# Altium schematic sheet 07-ZYNQ BANK 502.SchDoc
size 513 x 386 mm
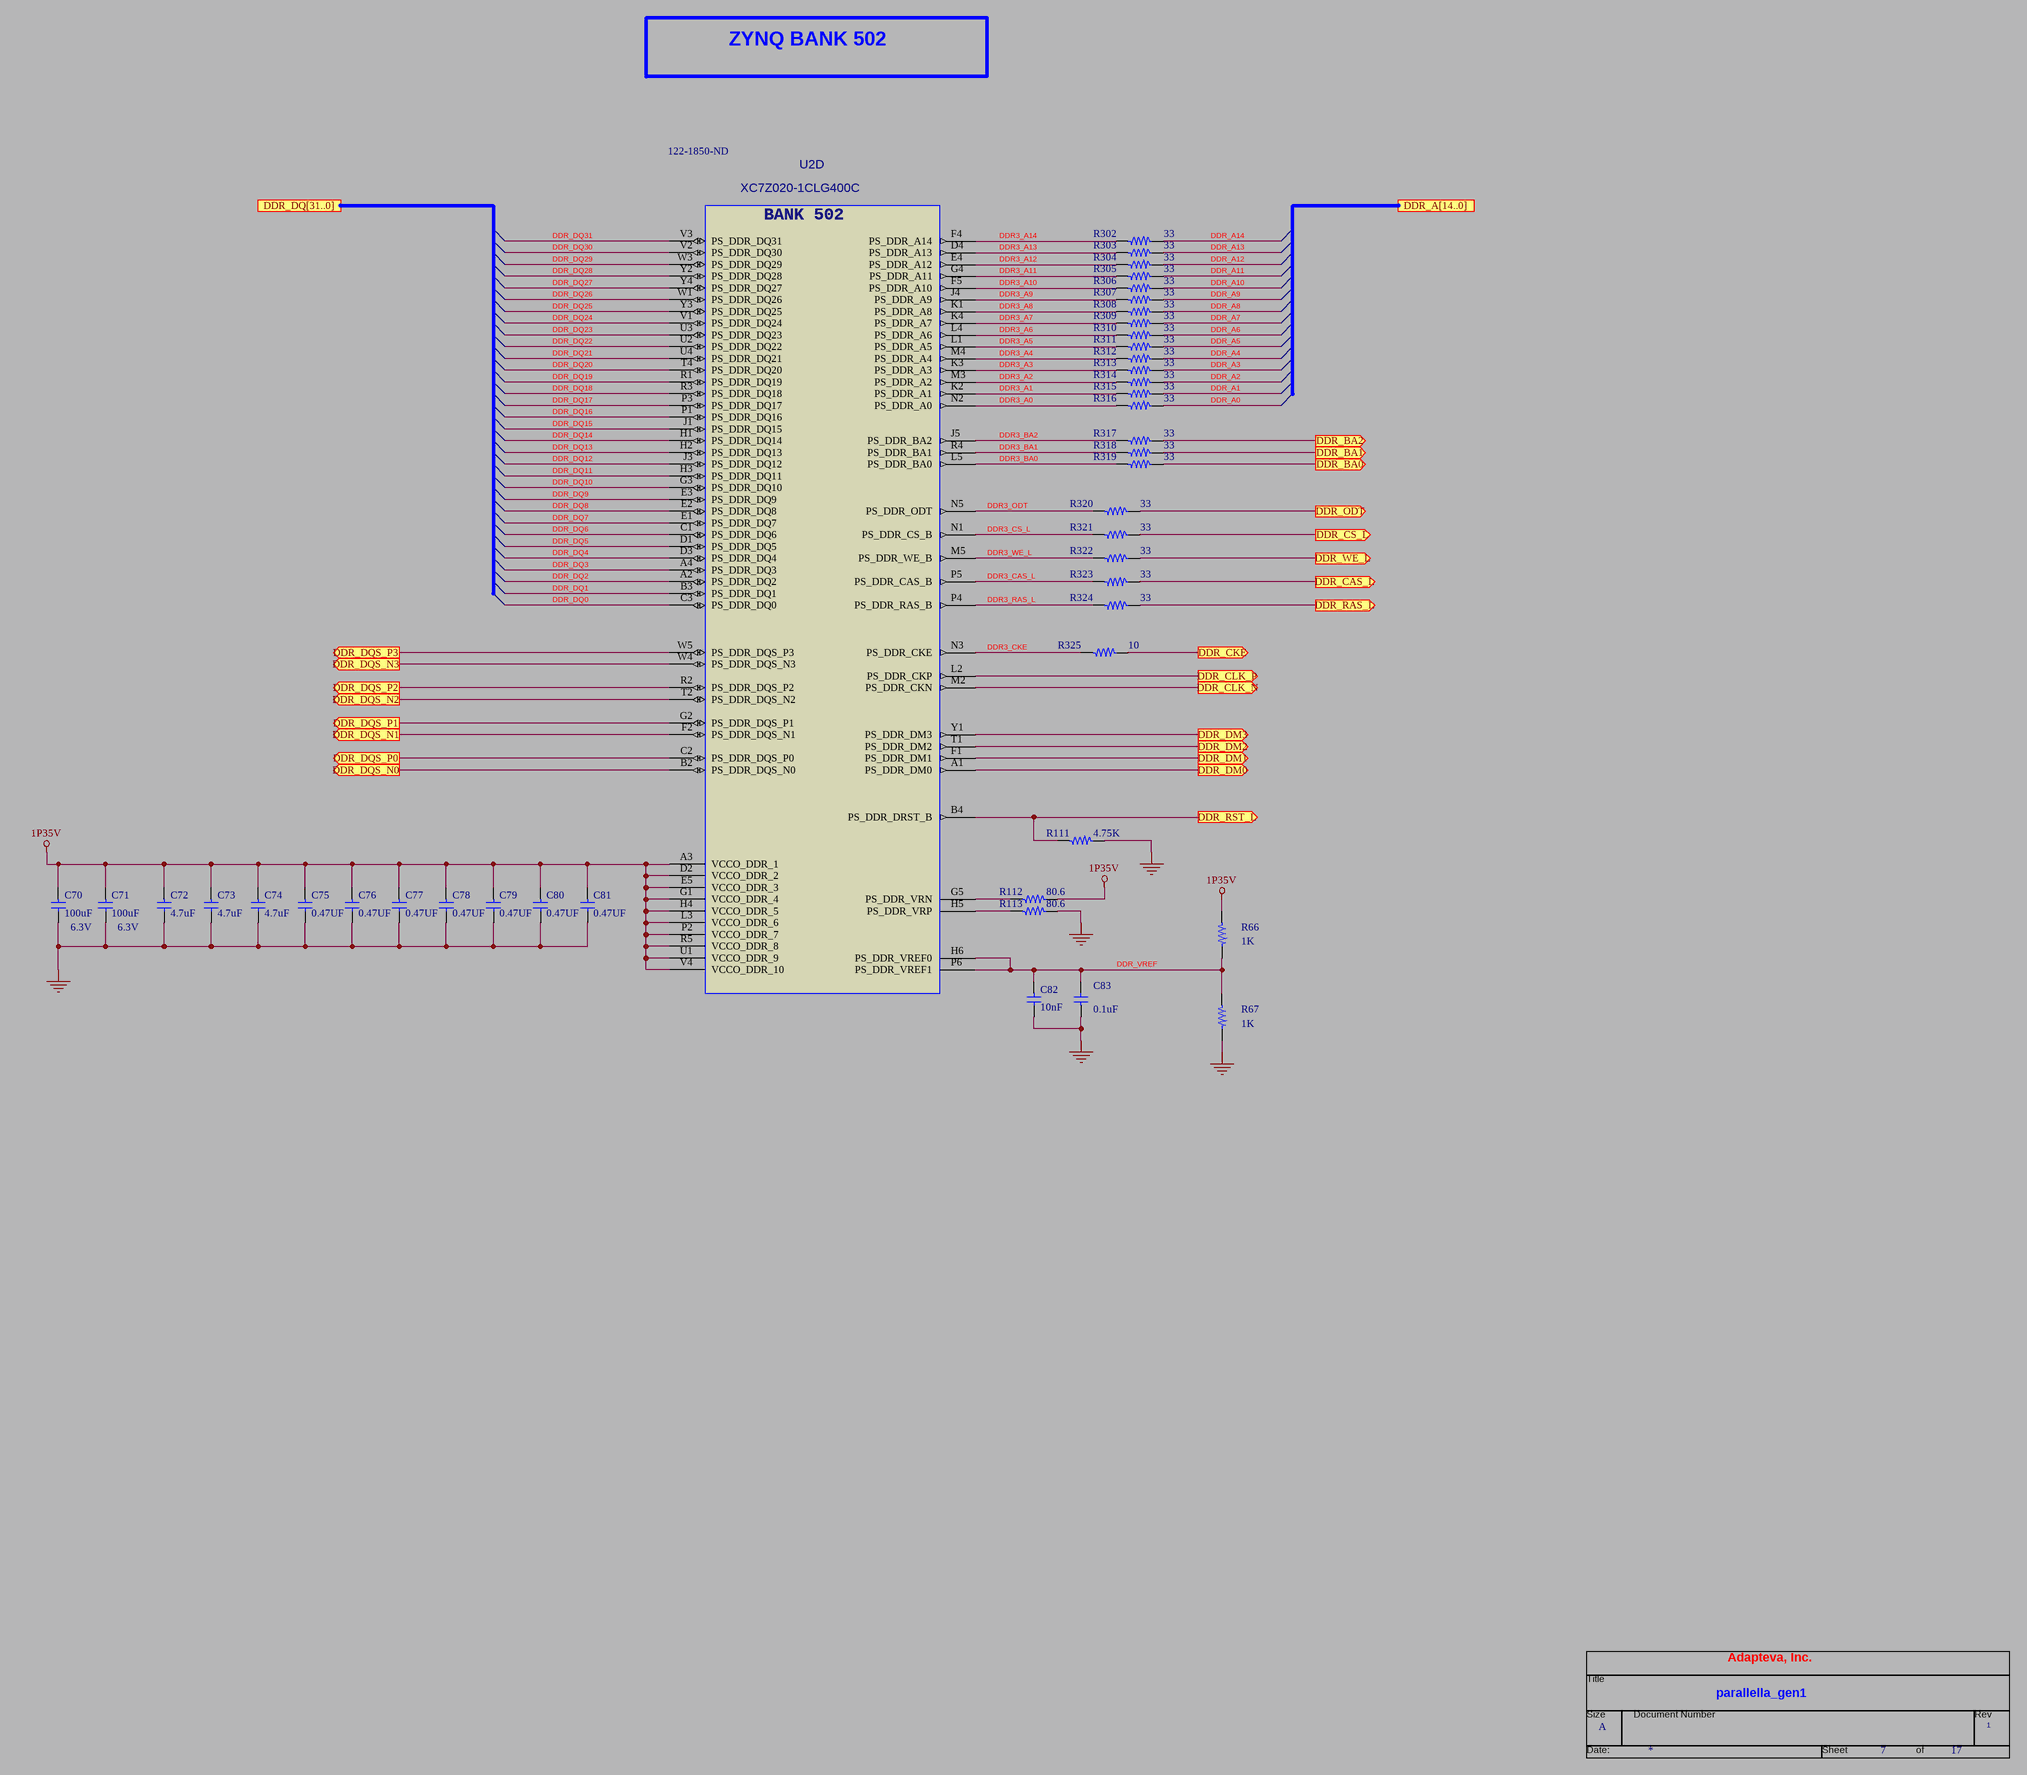
[diagram p0: 07-ZYNQ BANK 502.SchDoc]

## Parts
*  RevCode: 1  Title: parallella_gen1  Page Size: A  Page Number: 7  Page Count: 17  OrgAddr1: Adapteva, Inc.  (hidden comment: TitleBlock0)  (graphical)
C70  100uF  VOLTAGE: 6.3V  [C1210]
C71  100uF  VOLTAGE: 6.3V  [C1210]
C72  4.7uF  [C0402]
C73  4.7uF  [C0402]
C74  4.7uF  [C0402]
C75  0.47UF  [C0402]
C76  0.47UF  [C0402]
C77  0.47UF  [C0402]
C78  0.47UF  [C0402]
C79  0.47UF  [C0402]
C80  0.47UF  [C0402]
C81  0.47UF  [C0402]
C82  10nF  [C0402]
C83  0.1uF  [C0402]
R66  1K  [R0402]
R67  1K  [R0402]
R111  4.75K  [R0402]
R112  80.6  [R0402]
R113  80.6  [R0402]
R302  33  [R0402]
R303  33  [R0402]
R304  33  [R0402]
R305  33  [R0402]
R306  33  [R0402]
R307  33  [R0402]
R308  33  [R0402]
R309  33  [R0402]
R310  33  [R0402]
R311  33  [R0402]
R312  33  [R0402]
R313  33  [R0402]
R314  33  [R0402]
R315  33  [R0402]
R316  33  [R0402]
R317  33  [R0402]
R318  33  [R0402]
R319  33  [R0402]
R320  33  [R0402]
R321  33  [R0402]
R322  33  [R0402]
R323  33  [R0402]
R324  33  [R0402]
R325  10  [R0402]
U2  Vendor PN: XC7Z020-1CLG400C  Supplier Part Number 1: 122-1850-ND  [CBGA400_17SQ_1P6H_P8MMP]  (hidden comment: 7Z020-CLG400)  (part D of 8)

## Ports
DDR_A[14..0], DDR_BA0 (out), DDR_BA1 (out), DDR_BA2 (out), DDR_CAS_L (out), DDR_CKE (out), DDR_CLK_N (out), DDR_CLK_P (out), DDR_CS_L (out), DDR_DM0 (out), DDR_DM1 (out), DDR_DM2 (out), DDR_DM3 (out), DDR_DQ[31..0], DDR_DQS_N0 (out), DDR_DQS_N1 (out), DDR_DQS_N2 (out), DDR_DQS_N3 (out), DDR_DQS_P0 (out), DDR_DQS_P1 (out), DDR_DQS_P2 (out), DDR_DQS_P3 (out), DDR_ODT (out), DDR_RAS_L (out), DDR_RST_L (out), DDR_WE_L (out)

## Nets
1P35V: C70.1 C71.1 C72.1 C73.1 C74.1 C75.1 C76.1 C77.1 C78.1 C79.1 C80.1 C81.1 R66.1 R112.2 U2.A3(VCCO_DDR_1) U2.D2(VCCO_DDR_2) U2.E5(VCCO_DDR_3) U2.G1(VCCO_DDR_4) U2.H4(VCCO_DDR_5) U2.L3(VCCO_DDR_6) U2.P2(VCCO_DDR_7) U2.R5(VCCO_DDR_8) U2.U1(VCCO_DDR_9) U2.V4(VCCO_DDR_10)
GND: C70.2 C71.2 C72.2 C73.2 C74.2 C75.2 C76.2 C77.2 C78.2 C79.2 C80.2 C81.2 C82.2 C83.1 R67.2 R111.2 R113.2
DDR3_A0: R316.1 U2.N2(PS_DDR_A0)
DDR3_A1: R315.1 U2.K2(PS_DDR_A1)
DDR3_A2: R314.1 U2.M3(PS_DDR_A2)
DDR3_A3: R313.1 U2.K3(PS_DDR_A3)
DDR3_A4: R312.1 U2.M4(PS_DDR_A4)
DDR3_A5: R311.1 U2.L1(PS_DDR_A5)
DDR3_A6: R310.1 U2.L4(PS_DDR_A6)
DDR3_A7: R309.1 U2.K4(PS_DDR_A7)
DDR3_A8: R308.1 U2.K1(PS_DDR_A8)
DDR3_A9: R307.1 U2.J4(PS_DDR_A9)
DDR3_A10: R306.1 U2.F5(PS_DDR_A10)
DDR3_A11: R305.1 U2.G4(PS_DDR_A11)
DDR3_A12: R304.1 U2.E4(PS_DDR_A12)
DDR3_A13: R303.1 U2.D4(PS_DDR_A13)
DDR3_A14: R302.1 U2.F4(PS_DDR_A14)
DDR3_BA0: R319.1 U2.L5(PS_DDR_BA0)
DDR3_BA1: R318.1 U2.R4(PS_DDR_BA1)
DDR3_BA2: R317.1 U2.J5(PS_DDR_BA2)
DDR3_CAS_L: R323.1 U2.P5(PS_DDR_CAS_B)
DDR3_CKE: R325.1 U2.N3(PS_DDR_CKE)
DDR3_CS_L: R321.1 U2.N1(PS_DDR_CS_B)
DDR3_ODT: R320.1 U2.N5(PS_DDR_ODT)
DDR3_RAS_L: R324.1 U2.P4(PS_DDR_RAS_B)
DDR3_WE_L: R322.1 U2.M5(PS_DDR_WE_B)
DDR_A0: R316.2
DDR_A1: R315.2
DDR_A2: R314.2
DDR_A3: R313.2
DDR_A4: R312.2
DDR_A5: R311.2
DDR_A6: R310.2
DDR_A7: R309.2
DDR_A8: R308.2
DDR_A9: R307.2
DDR_A10: R306.2
DDR_A11: R305.2
DDR_A12: R304.2
DDR_A13: R303.2
DDR_A14: R302.2
DDR_BA0: R319.2 ; port DDR_BA0
DDR_BA1: R318.2 ; port DDR_BA1
DDR_BA2: R317.2 ; port DDR_BA2
DDR_CAS_L: R323.2 ; port DDR_CAS_L
DDR_CKE: R325.2 ; port DDR_CKE
DDR_CLK_N: U2.M2(PS_DDR_CKN) ; port DDR_CLK_N
DDR_CLK_P: U2.L2(PS_DDR_CKP) ; port DDR_CLK_P
DDR_CS_L: R321.2 ; port DDR_CS_L
DDR_DM0: U2.A1(PS_DDR_DM0) ; port DDR_DM0
DDR_DM1: U2.F1(PS_DDR_DM1) ; port DDR_DM1
DDR_DM2: U2.T1(PS_DDR_DM2) ; port DDR_DM2
DDR_DM3: U2.Y1(PS_DDR_DM3) ; port DDR_DM3
DDR_DQ0: U2.C3(PS_DDR_DQ0)
DDR_DQ1: U2.B3(PS_DDR_DQ1)
DDR_DQ2: U2.A2(PS_DDR_DQ2)
DDR_DQ3: U2.A4(PS_DDR_DQ3)
DDR_DQ4: U2.D3(PS_DDR_DQ4)
DDR_DQ5: U2.D1(PS_DDR_DQ5)
DDR_DQ6: U2.C1(PS_DDR_DQ6)
DDR_DQ7: U2.E1(PS_DDR_DQ7)
DDR_DQ8: U2.E2(PS_DDR_DQ8)
DDR_DQ9: U2.E3(PS_DDR_DQ9)
DDR_DQ10: U2.G3(PS_DDR_DQ10)
DDR_DQ11: U2.H3(PS_DDR_DQ11)
DDR_DQ12: U2.J3(PS_DDR_DQ12)
DDR_DQ13: U2.H2(PS_DDR_DQ13)
DDR_DQ14: U2.H1(PS_DDR_DQ14)
DDR_DQ15: U2.J1(PS_DDR_DQ15)
DDR_DQ16: U2.P1(PS_DDR_DQ16)
DDR_DQ17: U2.P3(PS_DDR_DQ17)
DDR_DQ18: U2.R3(PS_DDR_DQ18)
DDR_DQ19: U2.R1(PS_DDR_DQ19)
DDR_DQ20: U2.T4(PS_DDR_DQ20)
DDR_DQ21: U2.U4(PS_DDR_DQ21)
DDR_DQ22: U2.U2(PS_DDR_DQ22)
DDR_DQ23: U2.U3(PS_DDR_DQ23)
DDR_DQ24: U2.V1(PS_DDR_DQ24)
DDR_DQ25: U2.Y3(PS_DDR_DQ25)
DDR_DQ26: U2.W1(PS_DDR_DQ26)
DDR_DQ27: U2.Y4(PS_DDR_DQ27)
DDR_DQ28: U2.Y2(PS_DDR_DQ28)
DDR_DQ29: U2.W3(PS_DDR_DQ29)
DDR_DQ30: U2.V2(PS_DDR_DQ30)
DDR_DQ31: U2.V3(PS_DDR_DQ31)
DDR_DQS_N0: U2.B2(PS_DDR_DQS_N0) ; port DDR_DQS_N0
DDR_DQS_N1: U2.F2(PS_DDR_DQS_N1) ; port DDR_DQS_N1
DDR_DQS_N2: U2.T2(PS_DDR_DQS_N2) ; port DDR_DQS_N2
DDR_DQS_N3: U2.W4(PS_DDR_DQS_N3) ; port DDR_DQS_N3
DDR_DQS_P0: U2.C2(PS_DDR_DQS_P0) ; port DDR_DQS_P0
DDR_DQS_P1: U2.G2(PS_DDR_DQS_P1) ; port DDR_DQS_P1
DDR_DQS_P2: U2.R2(PS_DDR_DQS_P2) ; port DDR_DQS_P2
DDR_DQS_P3: U2.W5(PS_DDR_DQS_P3) ; port DDR_DQS_P3
DDR_ODT: R320.2 ; port DDR_ODT
DDR_RAS_L: R324.2 ; port DDR_RAS_L
DDR_RST_L: R111.1 U2.B4(PS_DDR_DRST_B) ; port DDR_RST_L
DDR_VREF: C82.1 C83.2 R66.2 R67.1 U2.H6(PS_DDR_VREF0) U2.P6(PS_DDR_VREF1)
DDR_WE_L: R322.2 ; port DDR_WE_L
NetR112_1: R112.1 U2.G5(PS_DDR_VRN)
NetR113_1: R113.1 U2.H5(PS_DDR_VRP)

## Notes on the sheet
- ZYNQ BANK 502
- (in symbol TitleBlock0) Title; Size; Document Number; Rev; Date:; Sheet; of
- (in symbol ZYNQ_7Z020_CLG400, part D) BANK 502

## Library data of the parts
C70 C71 = CAP1210_100UF_X5R_LOESR: CAP, 1210, 100UF, X5R, 6.3V, LOW ESR; MFG PART NO: GRM32ER60J107ME20L; MFG: MURATA; DEVICE: CAP1210_100UF_X5R_LOESR; Vendor: MURATA; Vendor PN: GRM32ER60J107ME20L; PCB Footprint: C1210
C72-C74 = CAP0402_4P7UF_X5R: CAP, 0402, 4.7UF, X5R, 6.3V; MFG PART NO: C1005X5R0J475K; MFG: TDK; ALT_SYMBOLS: C0402_BGA; DEVICE: CAP0402_4P7UF_X5R; Vendor: TDK; Vendor PN: C1005X5R0J475K; PCB Footprint: C0402
C75-C81 = CAP0402_0P47UF_X5R: CAP, 0402, 0.47UF, X5R, 16V; MFG PART NO: C1005X5R1C474K; MFG: TDK; ALT_SYMBOLS: C0402_BGA; DEVICE: CAP0402_0P47UF_X5R; Vendor: TDK; Vendor PN: C1005X5R1C474K; PCB Footprint: C0402
C82 = CAP0402_10NF_X7R_16V: CAP, 0402, 10NF, X7R, 16V; MFG PART NO: C1005X7R1C103K; MFG: TDK; ALT_SYMBOLS: C0402_BGA; Vendor: TDK; Vendor PN: C1005X7R1C103K; PCB Footprint: C0402
C83 = CAP0402_0P1UF_X5R_35V: CAP, 0402, 0.1UF, X5R, 35V; ALT_SYMBOLS: C0402_BGA; Vendor PN: GMK105BJ104KV-F; Vendor: TAIYO YUDEN; DEVICE: CAP0402_0P1UF_X5R_35V; MFG PART NO: GMK105BJ104KV-F; MFG: TAIYO YUDEN; PCB Footprint: C0402
R66 R67 = RES0402_1K: RES, 0402, 1K; MFG PART NO: CRCW04021K00FKED; ALT_SYMBOLS: R0402_BGA; MFG: VISHAY; Vendor: VISHAY/DALE; DEVICE: RES0402_1K; Vendor PN: CRCW04021K00FKED; PCB Footprint: R0402
R111 = RES0402_4K75: RES, 0402, 4.75K, 1%; MFG PART NO: CRCW04024K75FKED; MFG: VISHAY; Vendor: VISHAY/DALE; ALT_SYMBOLS: R0402_BGA; DEVICE: RES0402_4K75; Vendor PN: CRCW04024K75FKED; PCB Footprint: R0402
R112 R113 = RES0402_80P6: RES, 0402, 80.6, 1%; MFG PART NO: CRCW040280R6FKED; MFG: VISHAY; Vendor: VISHAY/DALE; ALT_SYMBOLS: R0402_BGA; DEVICE: RES0402_80P6; Vendor PN: CRCW040280R6FKED; PCB Footprint: R0402
R302-R324 = RES0402_33: RES, 0402, 33, 1%; MFG PART NO: CRCW040233R0FKED; MFG: VISHAY; Vendor: VISHAY/DALE; ALT_SYMBOLS: R0402_BGA; DEVICE: RES0402_33; Vendor PN: CRCW040233R0FKED; PCB Footprint: R0402
R325 = RES0402_10: RES, 0402, 10, 1%; Vendor PN: CRCW040210R0FKED; Vendor: VISHAY/DALE; MFG: VISHAY; ALT_SYMBOLS: R0402_BGA; MFG PART NO: CRCW040210R0FKED; DEVICE: RES0402_10; PCB Footprint: R0402
U2 = ZYNQ_7Z020_CLG400: IC, EPP, XILINX, ZYNQ, 7Z020, CLG400; SPLIT_INST: TRUE; Vendor: XILINX; DEVICE: ZYNQ_7Z020_CLG400; PCB Footprint: CBGA400_17SQ_1P6H_P8MMP; Supplier 1: Digi-Key
* = TitleBlock0: Page Create Date: March  8, 1995; Page Modify Date: *